# Altium schematic sheet ESP_Grow_Main_Rev_A_2_3V_5V.SchDoc: ESP-Grow_Rev_A_3V_5V
size A; Date: 5/4/2019; Author: Kyle R; Revision: A; SheetNumber: 2; SheetTotal: 2
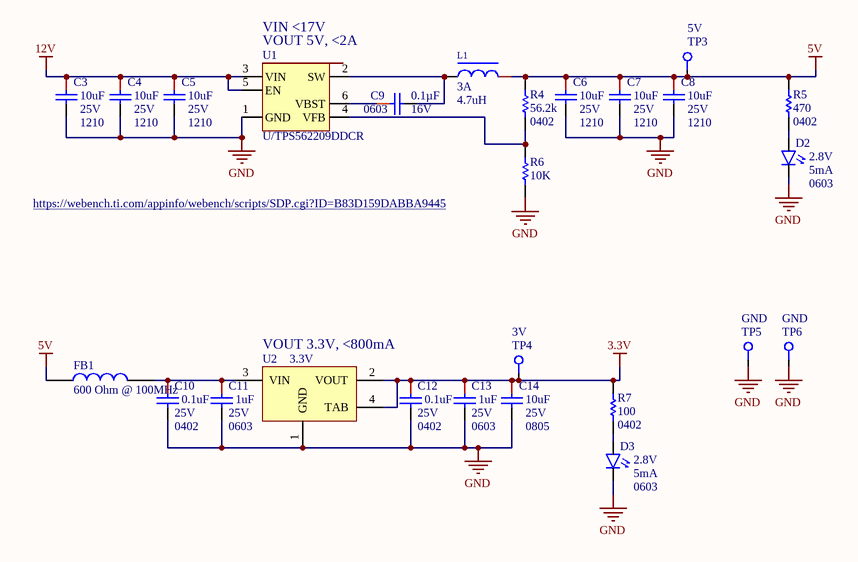
[diagram p0: ESP_Grow_Main_Rev_A_2_3V_5V.SchDoc]

## Parts
C3  10uF  Package / Case: 1210  Voltage Rated: 25V  [CAPC1210(3225)_N]
C4  10uF  Package / Case: 1210  Voltage Rated: 25V  [CAPC1210(3225)_N]
C5  10uF  Package / Case: 1210  Voltage Rated: 25V  [CAPC1210(3225)_N]
C6  10uF  Package / Case: 1210  Voltage Rated: 25V  [CAPC1210(3225)_N]
C7  10uF  Package / Case: 1210  Voltage Rated: 25V  [CAPC1210(3225)_N]
C8  10uF  Package / Case: 1210  Voltage Rated: 25V  [CAPC1210(3225)_N]
C9  Capacitance: 0.1µF  Package / Case: 0603  Voltage - Rated: 16V  [CAPC0603(1608)_L]  (hidden comment: 0.1uF)
C10  0.1uF  Package / Case: 0402  Voltage - Rated: 25V  [CAPC0402(1005)_N]
C11  1uF  Voltage - Rated: 25V  Package / Case: 0603  [CAPC0603(1608)_N]
C12  0.1uF  Package / Case: 0402  Voltage - Rated: 25V  [CAPC0402(1005)_N]
C13  1uF  Voltage - Rated: 25V  Package / Case: 0603  [CAPC0603(1608)_N]
C14  10uF  Voltage - Rated: 25V  Package / Case: 0805  [CAPC0805(2012)_L]
D2  Package / Case: 0603  Current - Test: 5mA  Voltage - Forward (Vf) (Typ): 2.8V  [D/0603]  (hidden comment: D/LEDB/0603)
D3  Package / Case: 0603  Current - Test: 5mA  Voltage - Forward (Vf) (Typ): 2.8V  [D/0603]  (hidden comment: D/LEDB/0603)
FB1  600 Ohm @ 100MHz  [RESC0805(2012)_N]
L1  Current Rating (Amps): 3A  [INDP6060X45N]  (hidden comment: 4.7uH)
R4  Resistance (Ohms): 56.2k  Package / Case: 0402  [RESC0402(1005)_N]  (hidden comment: 56.2K 1%)
R5  Package / Case: 0402  [RESC0402(1005)_N]  (hidden comment: 470)
R6  10K  [RESC0402(1005)_N]
R7  100  Supplier Device Package: 0402  [RESC0402(1005)_N]
TP3  5V  [Pogo-Testpoint]  (no BOM)
TP4  3V  [Pogo-Testpoint]  (no BOM)
TP5  GND  [Pogo-Testpoint]  (no BOM)
TP6  GND  [Pogo-Testpoint]  (no BOM)
U1  U/TPS562209DDCR  [SOT-23]
U2  3.3V  [DSO-G3]

## Nets
3.3V: C12.1 C13.1 C14.1 R7.2 TP4.1 U2.2(VOUT) U2.4(TAB)
5V: C6.1 C7.1 C8.1 FB1.1 L1.1 R4.2 R5.2 TP3.1
12V: C3.1 C4.1 C5.1 U1.3(VIN) U1.5(EN)
GND: C3.2 C4.2 C5.2 C6.2 C7.2 C8.2 C10.2 C11.2 C12.2 C13.2 C14.2 D2.1 D3.1 R6.1 TP5.1 TP6.1 U1.1(GND) U2.1(GND)
NetC9_1: C9.1 U1.6(VBST)
NetC9_2: C9.2 L1.2 U1.2(SW)
NetC10_1: C10.1 C11.1 FB1.2 U2.3(VIN)
NetD2_2: D2.2 R5.1
NetD3_2: D3.2 R7.1
NetR4_1: R4.1 R6.2 U1.4(VFB)

## Notes on the sheet
- (near U1) VIN <17V
- (near U1) VOUT 5V, <2A
- (near R6) https://webench.ti.com/appinfo/webench/scripts/SDP.cgi?ID=B83D159DABBA9445
- (near U2) VOUT 3.3V, <800mA

## Library data of the parts
C3-C8 = CAP CER 10UF 25V JB 1210: 10uF 1210 25V; Manufacturer: TDK Corporation; Manufacturer Part Number: C3225JB1E106K250AA; Tolerance: ±10%; Temperature Coefficient: JB; Notification: Current market demand for these product types have resulted in fluctuating and extending lead times. Lead times may differ.; Supplier 1: Digi-Key; RoHS: RoHS Compliant; Category: Capacitors; Stock 1: 19014; Pricing 1: 1=0.74, 10=0.525, 100=0.3454, 500=0.25588 (USD); Packaging: Cut Tape (CT); Part Status: Active; Operating Temperature: -25°C ~ 85°C; Ratings: -; Applications: General Purpose; Failure Rate: -; Mounting Type: Surface Mount, MLCC; Size / Dimension: 0.126" L x 0.098" W (3.20mm x 2.50mm); Height - Seated (Max): -; Thickness (Max): 0.110" (2.80mm); Lead Spacing: -; Lead Style: -; ComponentLink1URL: https://product.tdk.com/info/en/catalog/datasheets/mlcc_commercial_general_en.pdf; ComponentLink1Description: https://product.tdk.com/info/en/catalog/datasheets/mlcc_commercial_general_en.pdf; Supplier Part Number 1: 445-11850-1-ND; Voltage - Rated: 25V; Features: Low ESL
C9 = CAP CER 0.1UF 16V 10% X7R 0603: 0.1uF 0603 16V; Manufacturer: Kemet; Manufacturer Part Number: C0603C104K4RACTU; Tolerance: ±10%; Temperature Coefficient: X7R; Supplier 1: Digi-Key; RoHS: RoHS Compliant; Category: Capacitors; Stock 1: 2360000; Pricing 1: 4000=0.00414, 8000=0.00378, 12000=0.0036, 28000=0.00342, 100000=0.00248 (USD); Packaging: Tape & Reel (TR); Mounting Type: Surface Mount, MLCC; Operating Temperature: -55°C ~ 125°C; Applications: General Purpose; Ratings: -; Size / Dimension: 0.063" L x 0.031" W (1.60mm x 0.80mm); Height - Seated (Max): -; Thickness (Max): 0.034" (0.87mm); Lead Spacing: -; Features: -; Lead Style: -; ComponentLink1URL: http://www.kemet.com/datasheets&C0603C104K4RACTU; ComponentLink1Description: http://www.kemet.com/datasheets&C0603C104K4RACTU; Supplier Part Number 1: 399-1096-2-ND
C10 C12 = CAP CER 0.1UF 25V 10% X5R 0402: 0.1uF 0402 25V; Manufacturer: Taiyo Yuden; Manufacturer Part Number: TMK105BJ104KV-F; Tolerance: ±10%; Temperature Coefficient: X5R; Notification: Current market demand for these product types have resulted in fluctuating and extending lead times. Lead times may differ.; Supplier 1: Digi-Key; RoHS: RoHS Compliant; Category: Capacitors; Stock 1: 5172635; Pricing 1: 1=0.1, 10=0.043, 100=0.019, 500=0.0136, 1000=0.01069, 2500=0.00972, 5000=0.00894 (USD); Packaging: Cut Tape (CT); Part Status: Active; Operating Temperature: -55°C ~ 85°C; Features: -; Ratings: -; Applications: General Purpose; Mounting Type: Surface Mount, MLCC; Size / Dimension: 0.039" L x 0.020" W (1.00mm x 0.50mm); Height - Seated (Max): -; Thickness (Max): 0.022" (0.55mm); Lead Spacing: -; Lead Style: -; ComponentLink1URL: http://ds.yuden.co.jp/TYCOMPAS/ut/detail.do?productNo=TMK105BJ104KV-F&fileName=TMK105BJ104KV-F_SS&mode=specSheetDownload; ComponentLink1Description: http://ds.yuden.co.jp/TYCOMPAS/ut/detail.do?productNo=TMK105BJ104KV-F&fileName=TMK105BJ104KV-F_SS&mode=specSheetDownload; Supplier Part Number 1: 587-1456-1-ND
C11 C13 = CAP CER 1UF 25V 10% X7R 0603: 1uF 0603 25V; Manufacturer: TDK Corporation; Manufacturer Part Number: CGA3E1X7R1E105K080AC; Tolerance: ±10%; Temperature Coefficient: X7R; Supplier 1: Digi-Key; RoHS: RoHS Compliant; Category: Capacitors; Stock 1: 360610; Pricing 1: 1=0.2, 10=0.135, 100=0.0686, 500=0.04696, 1000=0.04154 (USD); Packaging: Cut Tape (CT); Part Status: Active; Operating Temperature: -55°C ~ 125°C; Features: -; Ratings: AEC-Q200; Applications: Automotive; Failure Rate: -; Mounting Type: Surface Mount, MLCC; Size / Dimension: 0.063" L x 0.032" W (1.60mm x 0.80mm); Height - Seated (Max): -; Thickness (Max): 0.035" (0.90mm); Lead Spacing: -; Lead Style: -; ComponentLink1URL: https://product.tdk.com/info/en/catalog/datasheets/mlcc_automotive_general_en.pdf; ComponentLink1Description: https://product.tdk.com/info/en/catalog/datasheets/mlcc_automotive_general_en.pdf; Supplier Part Number 1: 445-6931-1-ND
C14 = CAP CER 10UF 25V X6S 0805: 10UF 25V X6R 0805; Manufacturer: Murata Electronics North America; Manufacturer Part Number: GRM21BC81E106ME51L; Tolerance: ±20%; Temperature Coefficient: X6S; Notification: Current market demand for these product types have resulted in fluctuating and extending lead times. Lead times may differ.; Supplier 1: Digi-Key; RoHS: RoHS Compliant; Category: Capacitors; Stock 1: 23735; Pricing 1: 1=0.29, 10=0.199, 100=0.1009, 500=0.06906, 1000=0.0611 (USD); Packaging: Cut Tape (CT); Part Status: Active; Operating Temperature: -55°C ~ 105°C; Features: -; Ratings: -; Applications: General Purpose; Mounting Type: Surface Mount, MLCC; Size / Dimension: 0.079" L x 0.049" W (2.00mm x 1.25mm); Height - Seated (Max): -; Thickness (Max): 0.055" (1.40mm); Lead Spacing: -; Lead Style: -; ComponentLink1URL: http://search.murata.co.jp/Ceramy/image/img/A01X/G101/ENG/GRM21BC81E106ME51-01.pdf; ComponentLink1Description: http://search.murata.co.jp/Ceramy/image/img/A01X/G101/ENG/GRM21BC81E106ME51-01.pdf; Supplier Part Number 1: 490-10503-1-ND
FB1 = FERRITE 600 OHM 2.0A 0805: 600 OHM 0805 2.0A; Manufacturer: Wurth Electronics Inc; Manufacturer Part Number: 742792040; Current Rating: 2A; DC Resistance (DCR): 150 mOhm Max; Filter Type: Differential Mode - Single; Supplier 1: Digi-Key; RoHS: RoHS Compliant; Category: Filters; Stock 1: 34670; Pricing 1: 1=0.24, 50=0.2344, 100=0.2156, 500=0.20624, 1000=0.19687, 2000=0.1875 (USD); Packaging: Cut Tape (CT); Package / Case: 0805 (2012 Metric); Mounting Type: Surface Mount; Height (Max): 0.043" (1.10mm); Size / Dimension: 0.079" L x 0.047" W (2.00mm x 1.20mm); ComponentLink1URL: http://katalog.we-online.de/pbs/datasheet/742792040.pdf; ComponentLink1Description: http://katalog.we-online.de/pbs/datasheet/742792040.pdf; Supplier Part Number 1: 732-1620-1-ND; ClassName: *; Creator: osman; Impedance @ Frequency: 600 Ohm @ 100MHz
L1 = L/4.7uH/3A: FIXED IND 4.7UH 3A 37.6 MOHM SMD; Manufacturer Part Number: SRN6045-4R7Y; Current Saturation (Amps): 4A; Shielding: Semi-Shielded; DC Resistance (DCR): 37.6mOhm Max; Datasheet: https://www.bourns.com/data/global/pdfs/SRN6045.pdf; Size / Dimension: 0.236" L x 0.236" W (6.00mm x 6.00mm); Inductance: 4.7uH
R4 = RES 56.2K OHM 1% 1/10W 0402: 56.2K 1% 0402; Manufacturer: Panasonic Electronic Components; Manufacturer Part Number: ERJ-2RKF5622X; Power (Watts): 0.1W, 1/10W; Temperature Coefficient: ±100ppm/°C; Supplier 1: Digi-Key; RoHS: RoHS Compliant; Category: Resistors; Stock 1: 222789; Pricing 1: 1=0.1, 50=0.0124, 100=0.0091, 250=0.00692, 500=0.00554, 1000=0.00408, 5000=0.00293 (USD); Packaging: Cut Tape (CT); Part Status: Active; Tolerance: ±1%; Composition: Thick Film; Features: Automotive AEC-Q200; Operating Temperature: -55°C ~ 155°C; Supplier Device Package: 0402; Size / Dimension: 0.039" L x 0.020" W (1.00mm x 0.50mm); Height: 0.016" (0.40mm); Number of Terminations: 2; Failure Rate: -; ComponentLink1URL: http://industrial.panasonic.com/www-cgi/jvcr13pz.cgi?E+PZ+3+AOA0002+ERJ2RKF5622X+7+WW; ComponentLink1Description: http://industrial.panasonic.com/www-cgi/jvcr13pz.cgi?E+PZ+3+AOA0002+ERJ2RKF5622X+7+WW; Supplier Part Number 1: P56.2KLCT-ND
R5 = RES 470 OHM 1% 1/10W 0402: 470 0402; Manufacturer: Panasonic Electronic Components; Manufacturer Part Number: ERJ-2RKF4700X; Tolerance: ±1%; Power (Watts): 0.1W, 1/10W; Temperature Coefficient: ±100ppm/°C; Supplier 1: Digi-Key; RoHS: RoHS Compliant; Category: Resistors; Stock 1: 342632; Pricing 1: 1=0.1, 10=0.025, 25=0.018, 50=0.0136, 100=0.01, 250=0.00764, 500=0.00612, 1000=0.00451, 5000=0.00323 (USD); Packaging: Cut Tape (CT); Part Status: Active; Resistance (Ohms): 470; Composition: Thick Film; Features: Automotive AEC-Q200; Operating Temperature: -55°C ~ 155°C; Size / Dimension: 0.039" L x 0.020" W (1.00mm x 0.50mm); Height - Seated (Max): 0.016" (0.40mm); Number of Terminations: 2; Failure Rate: -; ComponentLink1URL: https://industrial.panasonic.com/cdbs/www-data/pdf/RDA0000/AOA0000C283.pdf; ComponentLink1Description: https://industrial.panasonic.com/cdbs/www-data/pdf/RDA0000/AOA0000C283.pdf; Supplier Part Number 1: P470LCT-ND; Supplier Device Package: 0402
R6 = RES 10K OHM 1% 1/16W 0402: 10K 0402; Manufacturer: Samsung Electro-Mechanics; Manufacturer Part Number: RC1005F103CS; Tolerance: ±1%; Power (Watts): 0.063W, 1/16W; Temperature Coefficient: ±100ppm/°C; Supplier 1: Digi-Key; RoHS: RoHS Compliant; Category: Resistors; Stock 1: 25834562; Pricing 1: 1=0.1, 10=0.021, 100=0.0086, 1000=0.00385, 2500=0.00334, 5000=0.00276 (USD); Packaging: Cut Tape (CT); Part Status: Active; Composition: Thick Film; Features: Moisture Resistant; Operating Temperature: -55°C ~ 155°C; Package / Case: 0402 (1005 Metric); Supplier Device Package: 0402; Size / Dimension: 0.039" L x 0.020" W (1.00mm x 0.50mm); Height - Seated (Max): 0.016" (0.40mm); Failure Rate: -; ComponentLink1URL: http://www.samsungsem.com/kr/support/product-search/chip-resistor/RC1005F103CS.jsp; ComponentLink1Description: http://www.samsungsem.com/kr/support/product-search/chip-resistor/RC1005F103CS.jsp; Supplier Part Number 1: 1276-3431-1-ND
R7 = RES 100 OHM 1% 1/16W 0402: 100 0402; Manufacturer: Yageo; Manufacturer Part Number: RC0402FR-07100RL; Tolerance: ±1%; Power (Watts): 0.063W, 1/16W; Temperature Coefficient: ±100ppm/°C; Supplier 1: Digi-Key; RoHS: RoHS Compliant; Category: Resistors; Stock 1: 14557677; Pricing 1: 1=0.1, 10=0.014, 100=0.0056, 1000=0.00253, 2500=0.0022, 5000=0.00181 (USD); Packaging: Cut Tape (CT); Part Status: Active; Composition: Thick Film; Features: Moisture Resistant; Operating Temperature: -55°C ~ 155°C; Package / Case: 0402 (1005 Metric); Size / Dimension: 0.039" L x 0.020" W (1.00mm x 0.50mm); Height - Seated (Max): 0.016" (0.40mm); Failure Rate: -; ComponentLink1URL: http://www.yageo.com/documents/recent/PYu-RC_Group_51_RoHS_L_8.pdf; ComponentLink1Description: http://www.yageo.com/documents/recent/PYu-RC_Group_51_RoHS_L_8.pdf; Supplier Part Number 1: 311-100LRCT-ND
TP3-TP6 = CMP-001-0557-03: Test Point- Current one; Pin Count: 1; Component Name: TestPoint; Designator: TestPoint
U1 = U/TPS562209DDCR: IC REG BUCK ADJ 2A TSOT23-6; Voltage - Input (Min): 4.5V; Voltage - Input (Max): 17V; Voltage - Output (Min/Fixed): 0.765V; Voltage - Output (Max): 7V; Frequency - Switching: 650KHZ; Manufacturer Part Number: TPS562209DDCR; Topology: Buck; Current - Output: 2A; Supplier Device Package: TSOT-23-6
U2 = LD1117S33: 3.3 volt fixed regulator, 800mA; Supplier 1: Digi-Key; Supplier Part Number 1: 497-1242-1-ND
D2 D3 = D/LEDB/0603: Datasheet: https://everlightamericas.com/index.php?controller=attachment&id_attachment=3217; Supplier 1: Digi-Key; Supplier Part Number 1: 1080-1562-6-ND